# EasyEDA schematic ESP32_MASTER_SLAVE.json

## Sheets
1 ESP32_Master_Slave
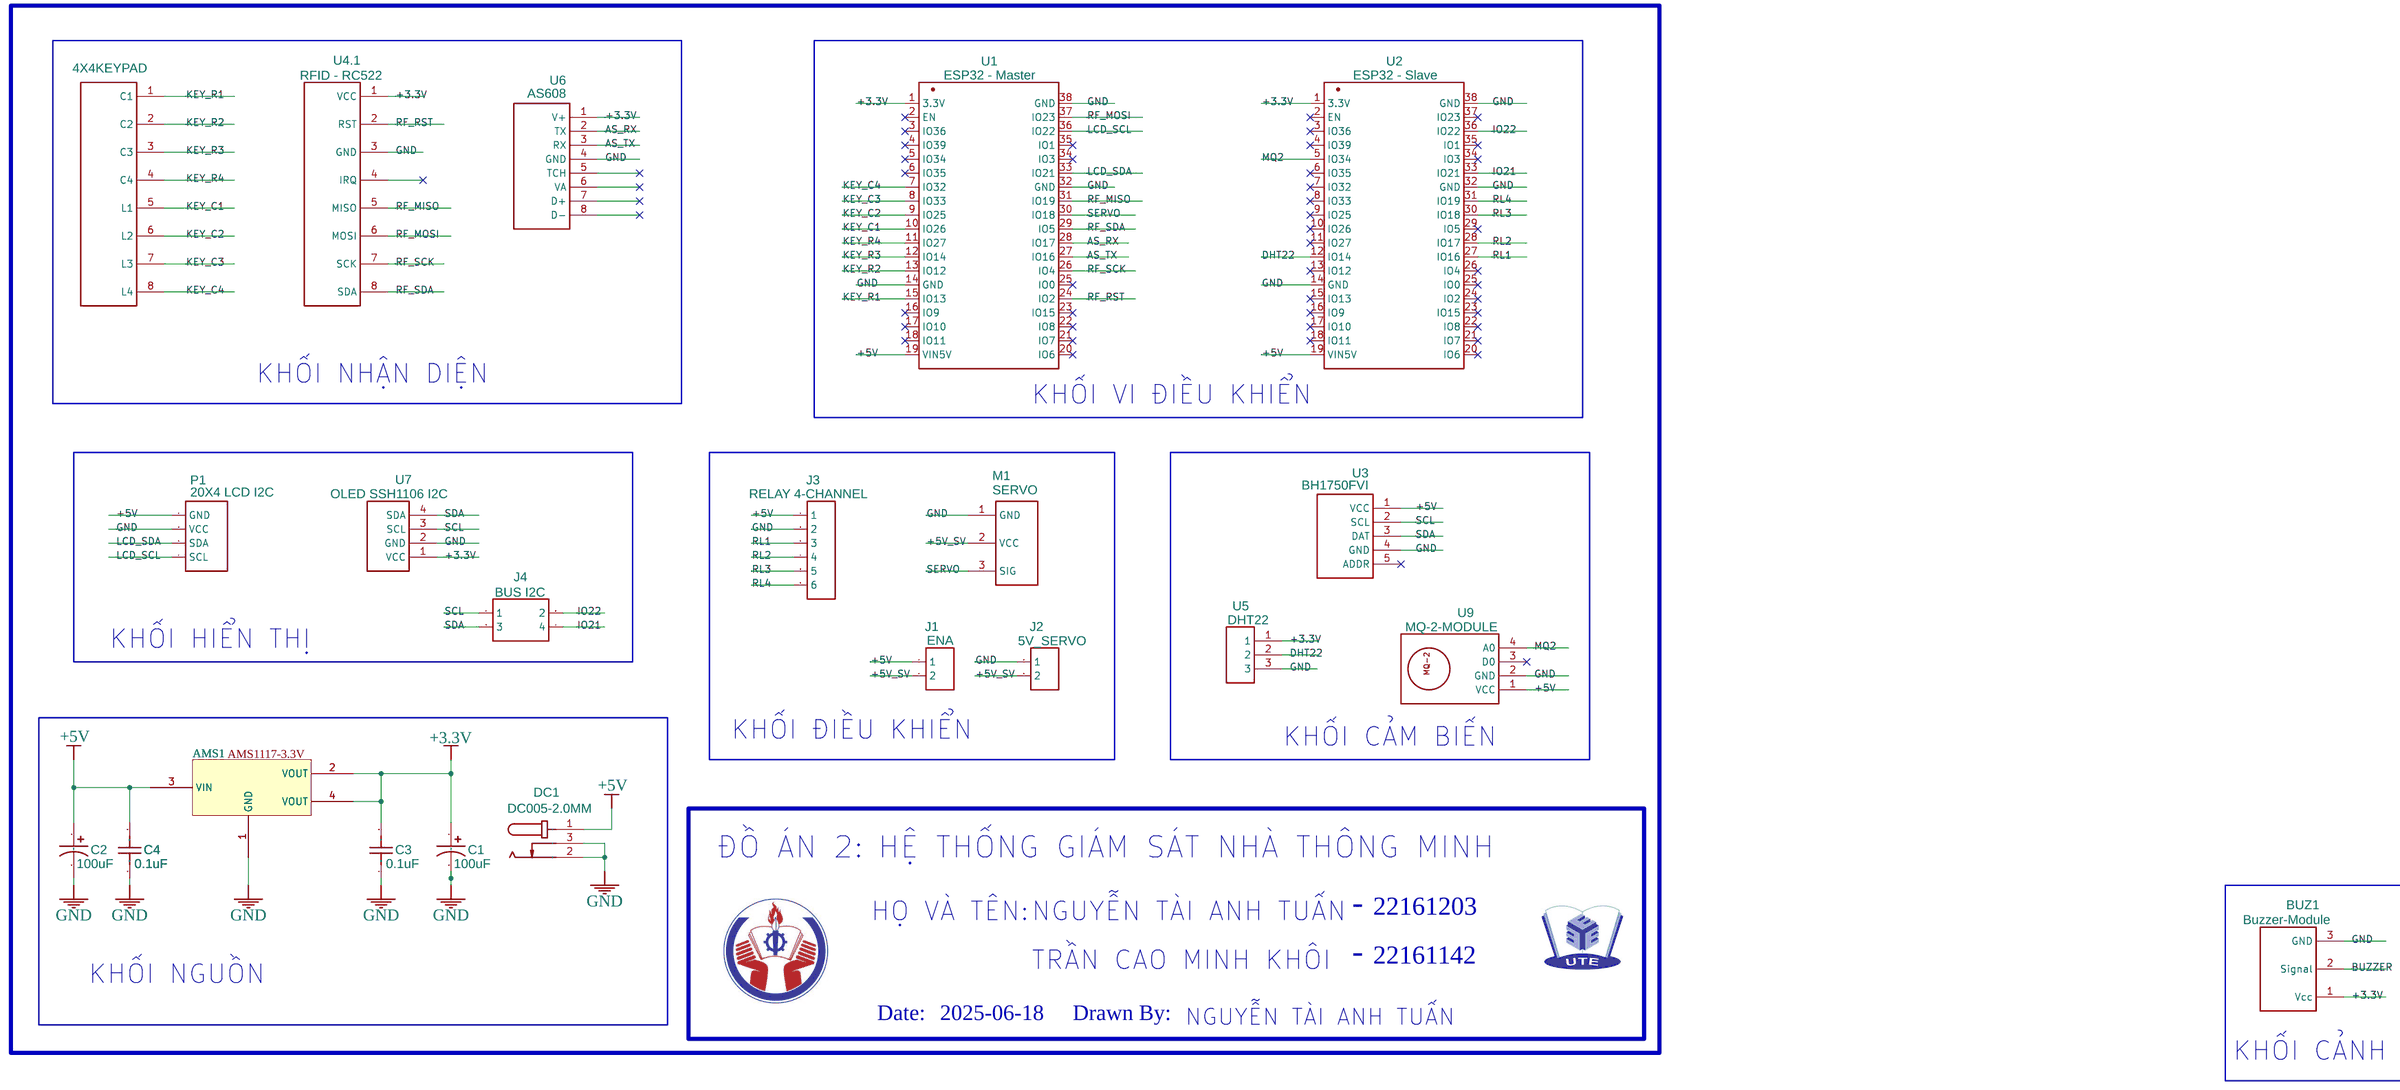
[diagram p0: ESP32_Master_Slave]
2 SDNL
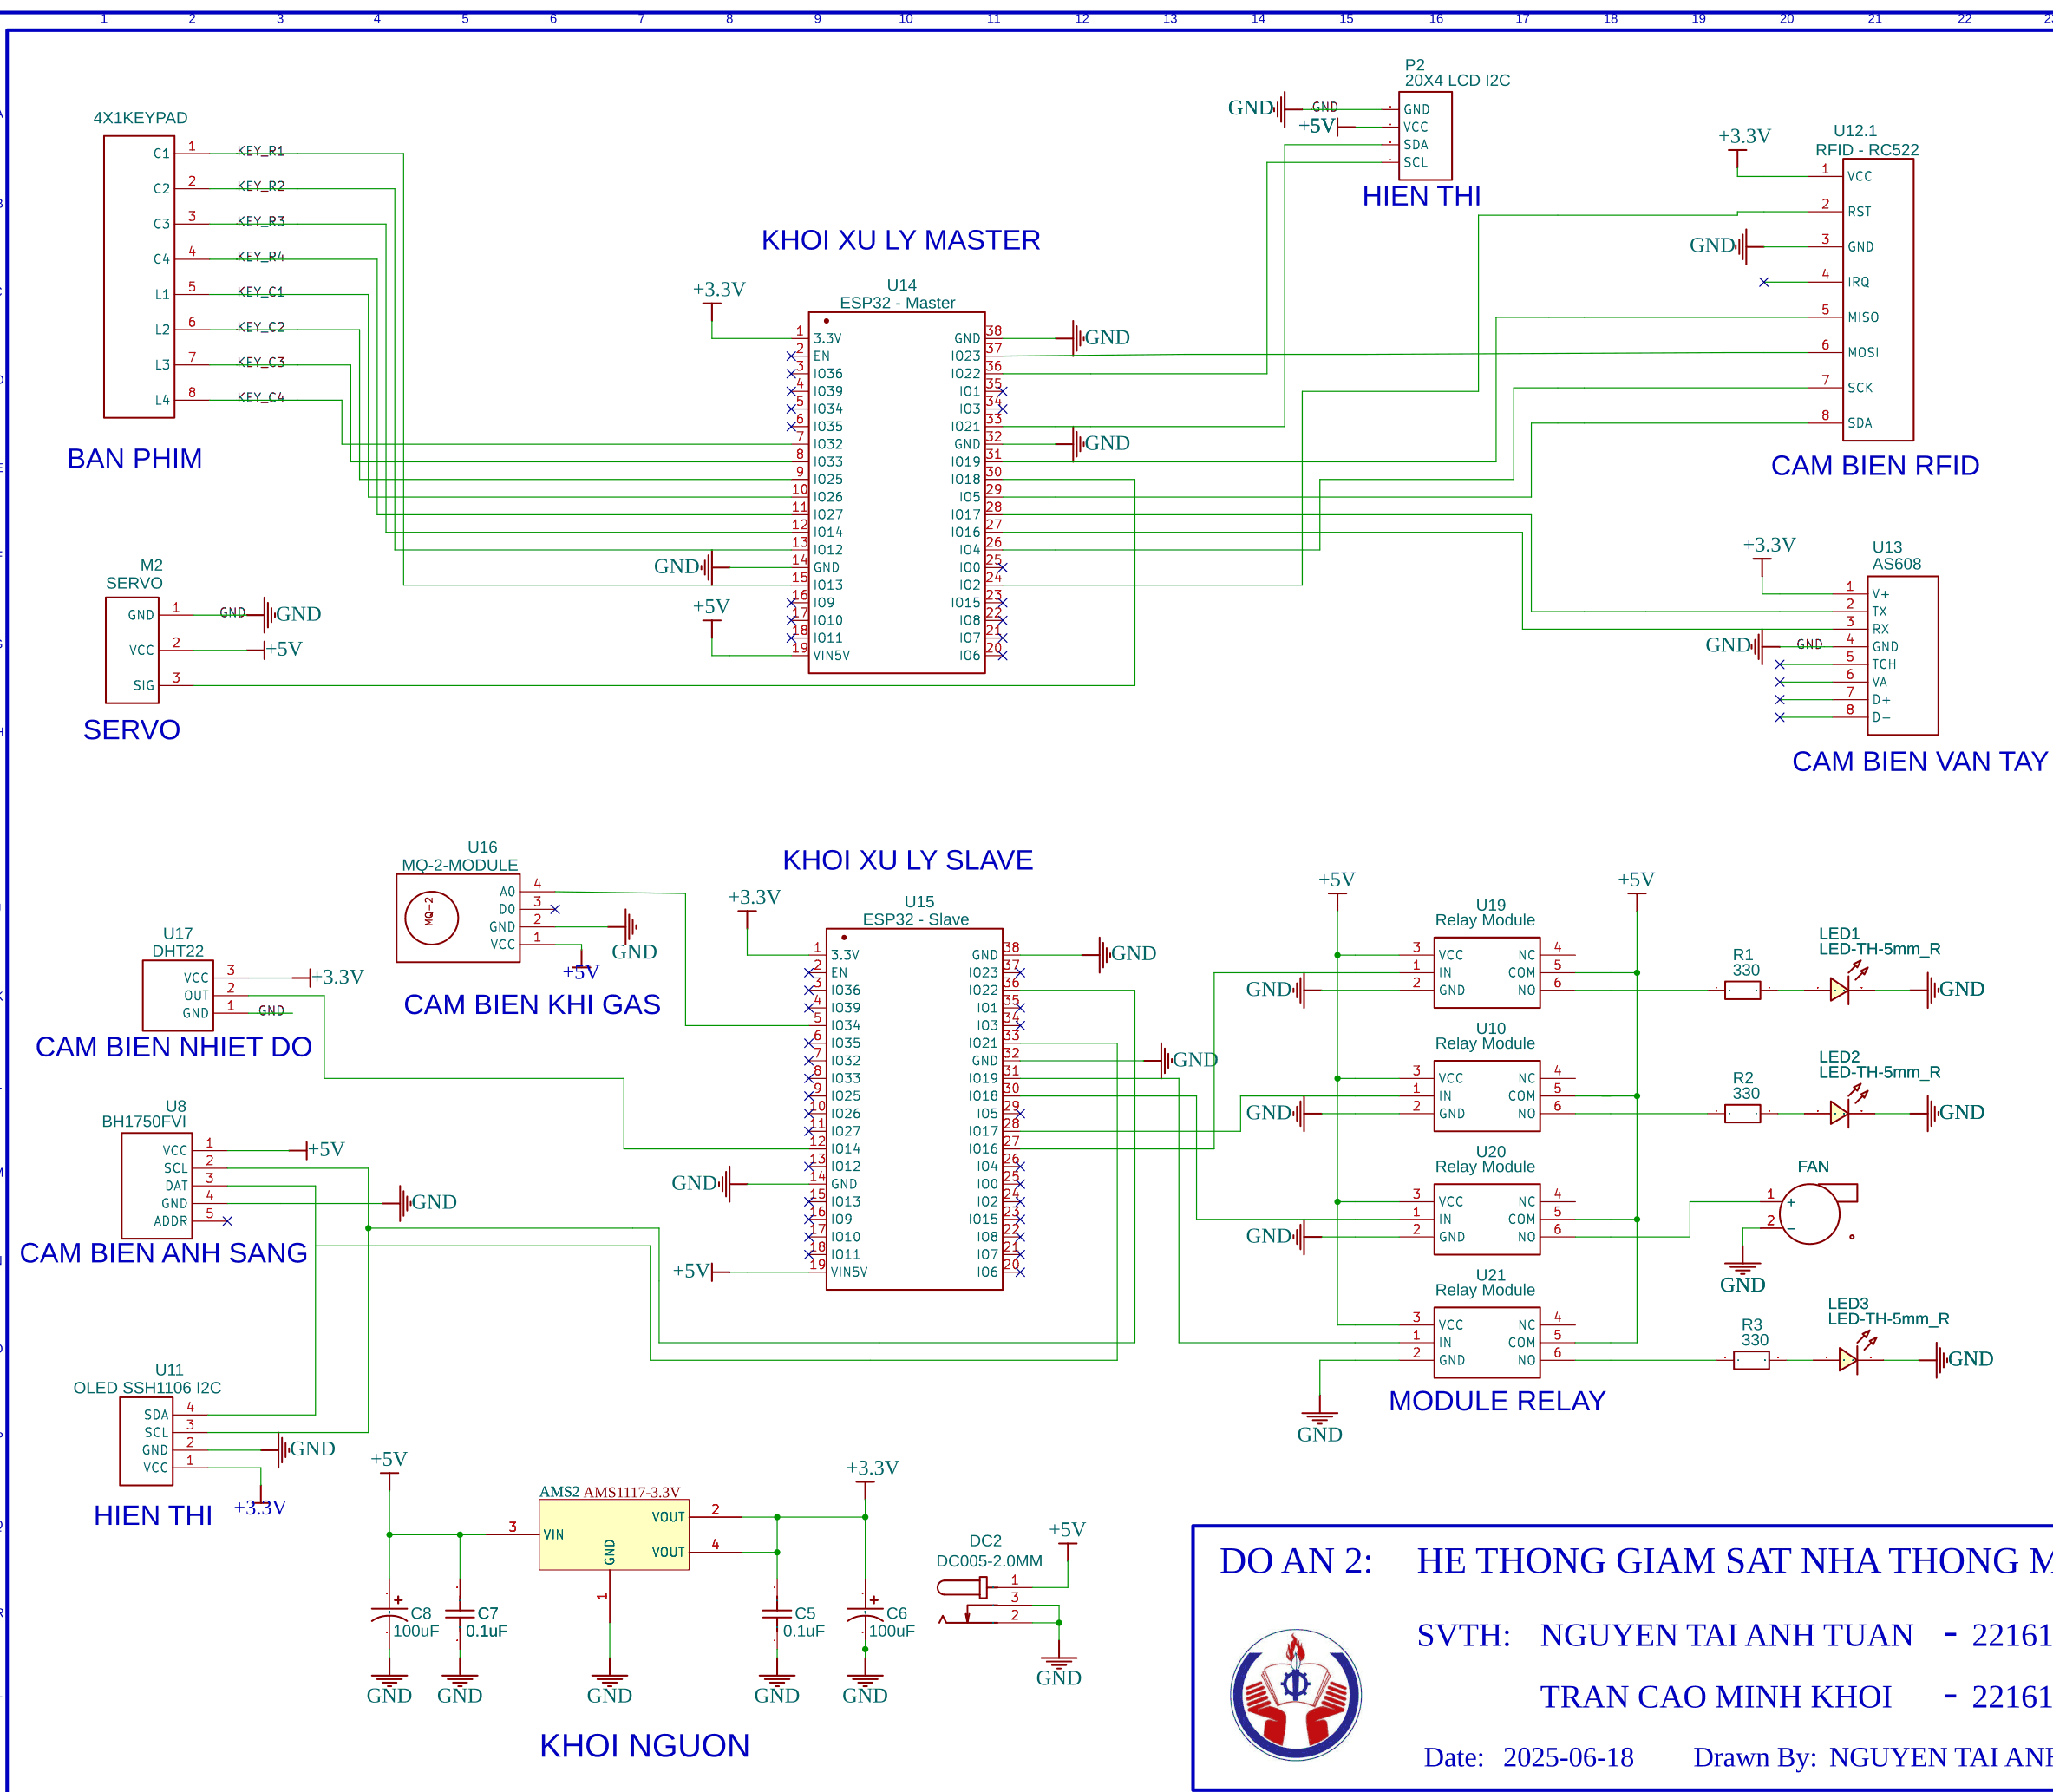
[diagram p1: SDNL]
3 Sheet_2
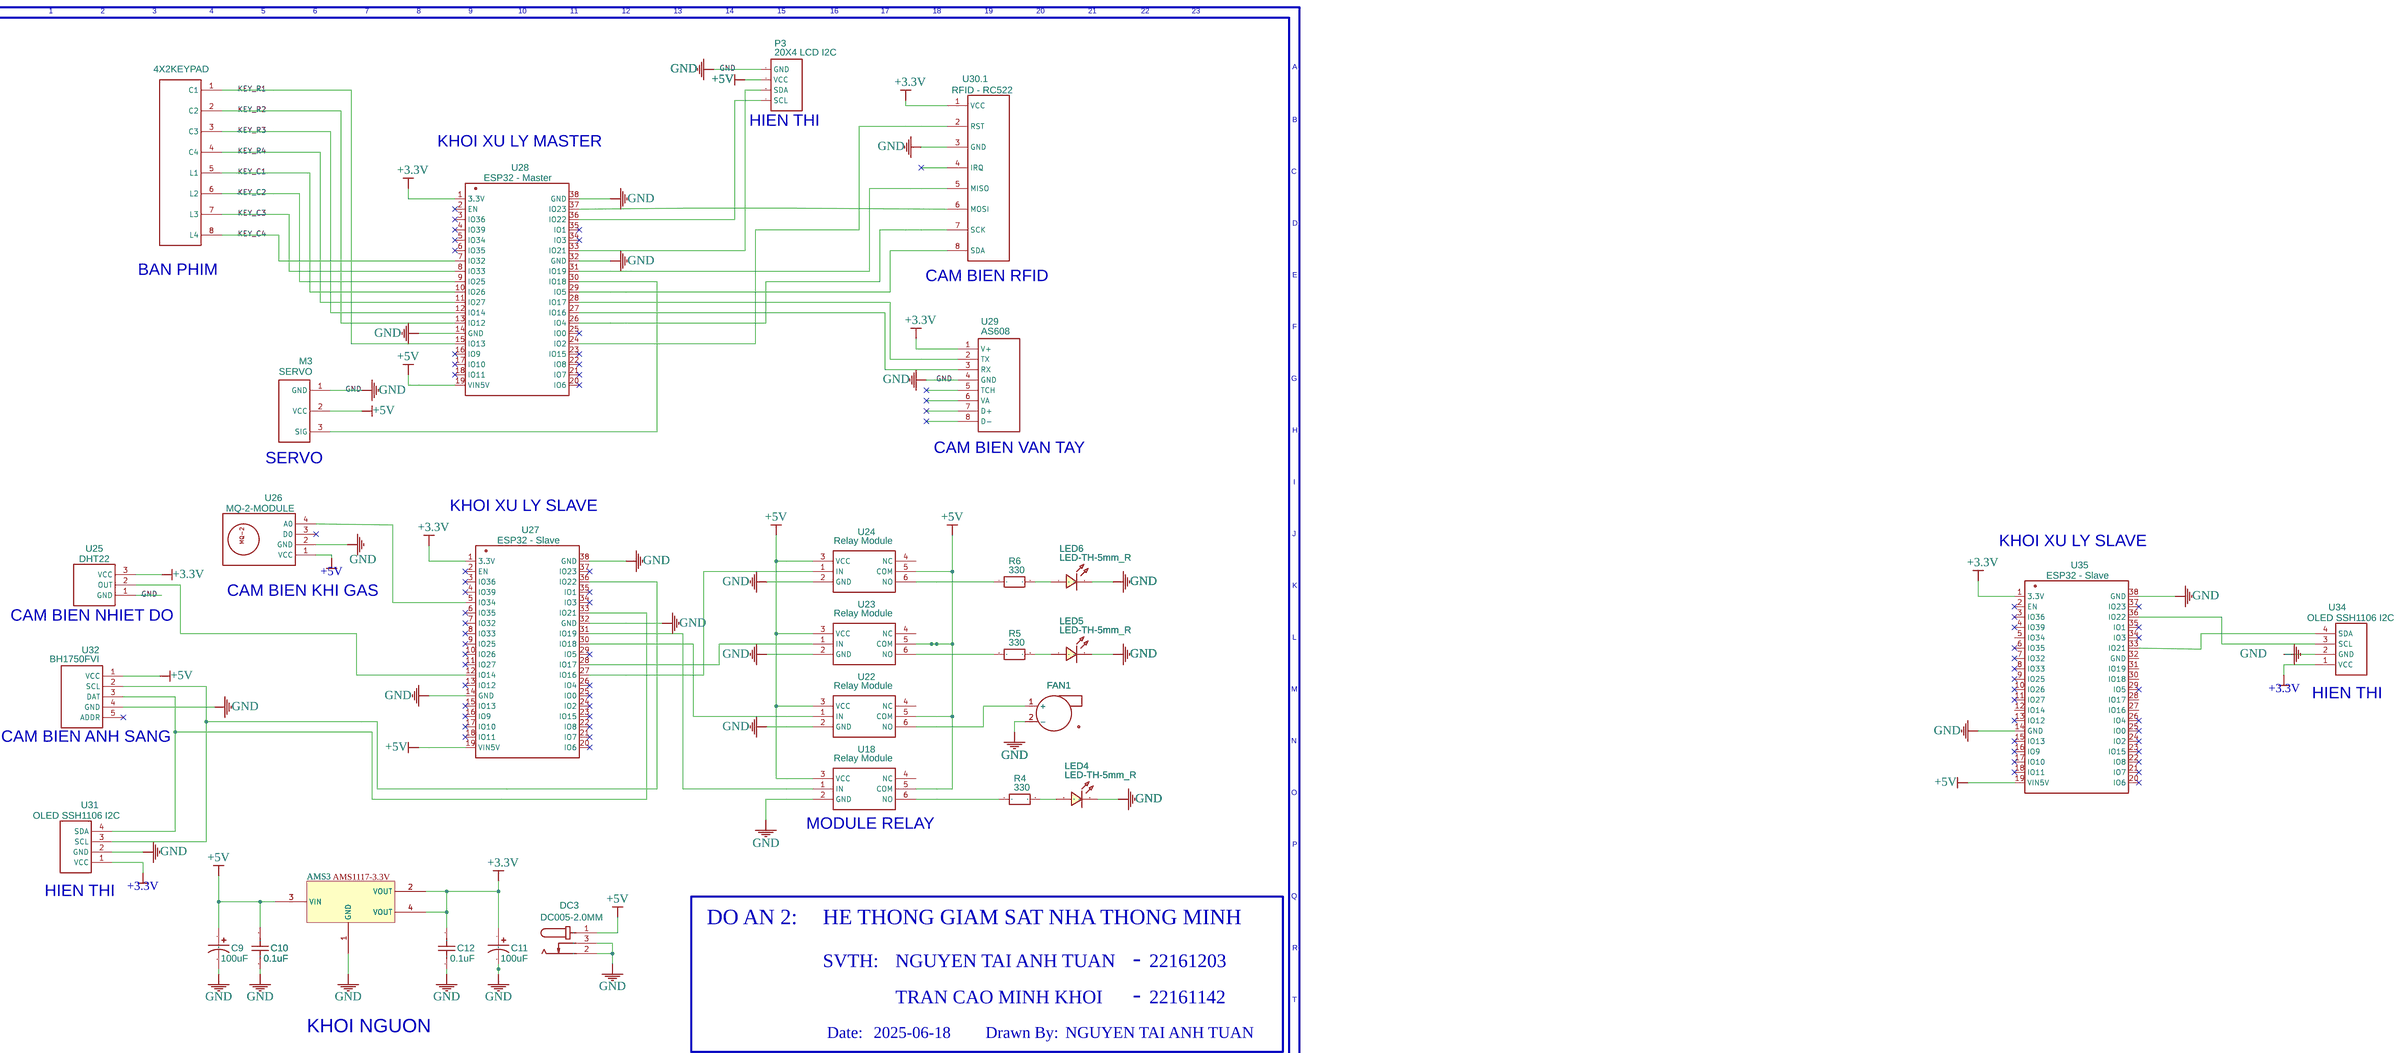
[diagram p2: Sheet_2]

## Parts
sheet ESP32_Master_Slave
4X4KEYPAD  4X4KEYPAD  [4X4KEYPAD]
AMS1  AMS1117-3.3V SOT223  [SOT223]
BUZ1  Buzzer-Module  [BUZZER-MODULE-EINAR]
C1  100uF  [CAP-D8.0×H10.5]
C2  100uF  [CAP-D8.0×H10.5]
C3  0.1uF  [C1206]
C4  0.1uF  [C1206]
DC1  DC005-2.0MM  [DC-IN-TH_DC005]
J1  ENA  [HDR-M-2.54_1X2]
J2  5V_SERVO  [HDR-M-2.54_1X2]
J3  RELAY 4-CHANNEL  [HDR-M-2.54_1X6]
J4  BUS I2C  [HDR-M-2.54_2X2]
M1  SERVO  [SERVO]
P1  20X4 LCD I2C  [20X4 LCD WITH I2C]
U1  ESP32 - Master  [ESP32-WROOM-32]
U2  ESP32 - Slave  [ESP32-WROOM-32]
U3  BH1750FVI  [BH1750FVI]
U4  RFID - RC522  [RFID-RC522]  (section 1)
U5  DHT22  [DHT22]
U6  AS608  [AS608]
U7  OLED SSH1106 I2C  [1.3_OLED_SSH1106_I2C_128X64_BOARD]
U9  MQ-2-MODULE  [SENSOR - MQ-2]
sheet SDNL
4X1KEYPAD  4X4KEYPAD  [4X4KEYPAD]
AMS2  AMS1117-3.3V SOT223  [SOT223]
C5  0.1uF  [C1206]
C6  100uF  [CAP-D8.0×H10.5]
C7  0.1uF  [C1206]
C8  100uF  [CAP-D8.0×H10.5]
DC2  DC005-2.0MM  [DC-IN-TH_DC005]
FAN  FAN  [FAN]
LED1  LED-TH-5mm_R  [LED-TH_BD5.0_RED]
LED2  LED-TH-5mm_R  [LED-TH_BD5.0_RED]
LED3  LED-TH-5mm_R  [LED-TH_BD5.0_RED]
M2  SERVO  [SERVO]
P2  20X4 LCD I2C  [20X4 LCD WITH I2C]
R1  330  [R0603]
R2  330  [R0603]
R3  330  [R0603]
U8  BH1750FVI  [BH1750FVI]
U10  Relay Module  [RELAY MODULE HW-279 2 RELAYS]
U11  OLED SSH1106 I2C  [1.3_OLED_SSH1106_I2C_128X64_BOARD]
U12  RFID - RC522  [RFID-RC522]  (section 1)
U13  AS608  [AS608]
U14  ESP32 - Master  [ESP32-WROOM-32]
U15  ESP32 - Slave  [ESP32-WROOM-32]
U16  MQ-2-MODULE  [SENSOR - MQ-2]
U17  DHT22  [DHT22]
U19  Relay Module  [RELAY MODULE HW-279 2 RELAYS]
U20  Relay Module  [RELAY MODULE HW-279 2 RELAYS]
U21  Relay Module  [RELAY MODULE HW-279 2 RELAYS]
sheet Sheet_2
4X2KEYPAD  4X4KEYPAD  [4X4KEYPAD]
AMS3  AMS1117-3.3V SOT223  [SOT223]
C9  100uF  [CAP-D8.0×H10.5]
C10  0.1uF  [C1206]
C11  100uF  [CAP-D8.0×H10.5]
C12  0.1uF  [C1206]
DC3  DC005-2.0MM  [DC-IN-TH_DC005]
FAN1  FAN  [FAN]
LED4  LED-TH-5mm_R  [LED-TH_BD5.0_RED]
LED5  LED-TH-5mm_R  [LED-TH_BD5.0_RED]
LED6  LED-TH-5mm_R  [LED-TH_BD5.0_RED]
M3  SERVO  [SERVO]
P3  20X4 LCD I2C  [20X4 LCD WITH I2C]
R4  330  [R0603]
R5  330  [R0603]
R6  330  [R0603]
U18  Relay Module  [RELAY MODULE HW-279 2 RELAYS]
U22  Relay Module  [RELAY MODULE HW-279 2 RELAYS]
U23  Relay Module  [RELAY MODULE HW-279 2 RELAYS]
U24  Relay Module  [RELAY MODULE HW-279 2 RELAYS]
U25  DHT22  [DHT22]
U26  MQ-2-MODULE  [SENSOR - MQ-2]
U27  ESP32 - Slave  [ESP32-WROOM-32]
U28  ESP32 - Master  [ESP32-WROOM-32]
U29  AS608  [AS608]
U30  RFID - RC522  [RFID-RC522]  (section 1)
U31  OLED SSH1106 I2C  [1.3_OLED_SSH1106_I2C_128X64_BOARD]
U32  BH1750FVI  [BH1750FVI]
U34  OLED SSH1106 I2C  [1.3_OLED_SSH1106_I2C_128X64_BOARD]
U35  ESP32 - Slave  [ESP32-WROOM-32]

## Library data of the parts
4X1KEYPAD 4X2KEYPAD 4X4KEYPAD = 4X4KEYPAD: Contributor: ilierazvan1497
AMS1-AMS3 = -: Don_Vi: Con; Ghi_Chu: *; Kieu_Chan: *; Ma_Hang: MH000596; Chung_Loai: Dán; Comment: AMS1117-3.3V
BUZ1 = Buzzer-Module-Einar: Contributor: einar2
C1 C2 C6 C8 C9 C11 = CE_SMD_D8.0×H10.5_US: Contributor: LCEDA_Lib
C3-C5 C7 C10 C12 = C_1206_US: Contributor: LCEDA_Lib
DC1-DC3 = DC005-2.0MM: Supplier: LCSC; Manufacturer: SOFNG; Supplier Part: C111567
J1 J2 = HDR-M-2.54_1x2: Supplier Part: C124375; Supplier: LCSC; Contributor: LCEDA_Lib
J3 = HDR-M-2.54_1x6: Supplier Part: C190819; Supplier: LCSC; Contributor: LCEDA_Lib
J4 = HDR-M-2.54_2x2: Supplier Part: C66690; Supplier: LCSC; Contributor: LCEDA_Lib
M1-M3 = SERVO: Manufacturer Part: New SchematicLib; Contributor: 陳詩函
P1-P3 = 20X4 LCD I2C: Supplier: LCSC; Manufacturer: ReliaPro; Manufacturer Part: Header-Female-2.54_1x4; Supplier Part: C124413
U1 U2 U14 U15 U27 U28 U35 = ESP32-WROOM-32_KEEYEES: Contributor: zamhxk
U3 U8 U32 = BH1750FVI: Contributor: van.habl
U4 U12 U30 = RC522 COPY COPY: Contributor: Baptiste Campion; subpart_no: 2
U5 = DHT22: Contributor: dasarisundeep1993
U6 U13 U29 = AS608: Supplier: Ambox; Contributor: v.v.vyalov
U7 U11 U31 U34 = 1.3in OLED SSH1106 I2C 128x64: Supplier: LIB1HR; Contributor: hrodriguez22
U9 U16 U26 = MQ-9-MODULE: Contributor: boerescu_daniel
FAN FAN1 = TURBINE COPY: Supplier: MOXA; Contributor: Aaron Ayala
LED1-LED6 = LED-TH-5mm_R: Manufacturer: EVERLIGHT(台湾亿光); Manufacturer Part: 333-2SURD/S530-A3; Supplier Part: C87271; Supplier: LCSC; Contributor: LCEDA_Lib
R1-R6 = R_0603_EU: Contributor: LCEDA_Lib
U10 U18-U24 = Relay Module 1 Channel: Contributor: abejero315
U17 U25 = DHT22: Supplier Part: C137589; Supplier: LCSC; Contributor: angelpool99

## Nets
+3.3V: AMS1.2(VOUT) AMS1.4(VOUT) AMS2.2(VOUT) AMS2.4(VOUT) AMS3.2(VOUT) AMS3.4(VOUT) BUZ1.1(Vcc) C1.1 C3.2 C5.2 C6.1 C11.1 C12.2 U1.1(3.3V) U2.1(3.3V) U4.1(VCC) U5.1 U6.1(V+) U7.1(VCC) U11.1(VCC) U12.1(VCC) U13.1(V+) U14.1(3.3V) U15.1(3.3V) U17.3(VCC) U25.3(VCC) U27.1(3.3V) U28.1(3.3V) U29.1(V+) U30.1(VCC) U31.1(VCC) U34.1(VCC) U35.1(3.3V)
+5V: AMS1.3(VIN) AMS2.3(VIN) AMS3.3(VIN) C2.1 C4.2 C7.2 C8.1 C9.1 C10.2 DC1.1 DC2.1 DC3.1 J1.1 J3.1 M2.2(VCC) M3.2(VCC) P1.1(GND) P2.2(VCC) P3.2(VCC) U1.19(VIN5V) U2.19(VIN5V) U3.1(VCC) U8.1(VCC) U9.1(VCC) U10.3(VCC) U14.19(VIN5V) U15.19(VIN5V) U16.1(VCC) U18.3(VCC) U18.5(COM) U19.3(VCC) U19.5(COM) U20.3(VCC) U20.5(COM) U21.3(VCC) U21.5(COM) U22.3(VCC) U22.5(COM) U23.3(VCC) U23.5(COM) U24.3(VCC) U24.5(COM) U26.1(VCC) U27.19(VIN5V) U28.19(VIN5V) U32.1(VCC) U35.19(VIN5V)
+5V_SV: J1.2 J2.2 M1.2(VCC)
GND: AMS1.1(GND) AMS2.1(GND) AMS3.1(GND) BUZ1.3(GND) C1.2 C2.2 C3.1 C4.1 C5.1 C6.2 C7.1 C8.2 C9.2 C10.1 C11.2 C12.1 DC1.2 DC1.3 DC2.2 DC2.3 DC3.2 DC3.3 FAN.2(-) FAN1.2(-) J2.1 J3.2 LED1.2 LED2.2 LED3.2 LED4.2 LED5.2 LED6.2 M1.1(GND) M2.1(GND) M3.1(GND) P1.2(VCC) P2.1(GND) P3.1(GND) U1.14(GND) U1.32(GND) U1.38(GND) U2.14(GND) U2.32(GND) U2.38(GND) U3.4(GND) U4.3(GND) U5.3 U6.4(GND) U7.2(GND) U8.4(GND) U9.2(GND) U10.2(GND) U11.2(GND) U12.3(GND) U13.4(GND) U14.14(GND) U14.32(GND) U14.38(GND) U15.14(GND) U15.32(GND) U15.38(GND) U16.2(GND) U17.1(GND) U18.2(GND) U19.2(GND) U20.2(GND) U21.2(GND) U22.2(GND) U23.2(GND) U24.2(GND) U25.1(GND) U26.2(GND) U27.14(GND) U27.32(GND) U27.38(GND) U28.14(GND) U28.32(GND) U28.38(GND) U29.4(GND) U30.3(GND) U31.2(GND) U32.4(GND) U34.2(GND) U35.14(GND) U35.38(GND)
AS_RX: U1.28(IO17) U6.2(TX)
AS_TX: U1.27(IO16) U6.3(RX)
BUZZER: BUZ1.2(Signal)
DHT22: U2.12(IO14) U5.2
IO21: J4.4 U2.33(IO21)
IO22: J4.2 U2.36(IO22)
KEY_C1: 4X1KEYPAD.5(L1) 4X2KEYPAD.5(L1) 4X4KEYPAD.5(L1) U1.10(IO26) U14.10(IO26) U28.10(IO26)
KEY_C2: 4X1KEYPAD.6(L2) 4X2KEYPAD.6(L2) 4X4KEYPAD.6(L2) U1.9(IO25) U14.9(IO25) U28.9(IO25)
KEY_C3: 4X1KEYPAD.7(L3) 4X2KEYPAD.7(L3) 4X4KEYPAD.7(L3) U1.8(IO33) U14.8(IO33) U28.8(IO33)
KEY_C4: 4X1KEYPAD.8(L4) 4X2KEYPAD.8(L4) 4X4KEYPAD.8(L4) U1.7(IO32) U14.7(IO32) U28.7(IO32)
KEY_R1: 4X1KEYPAD.1(C1) 4X2KEYPAD.1(C1) 4X4KEYPAD.1(C1) U1.15(IO13) U14.15(IO13) U28.15(IO13)
KEY_R2: 4X1KEYPAD.2(C2) 4X2KEYPAD.2(C2) 4X4KEYPAD.2(C2) U1.13(IO12) U14.13(IO12) U28.13(IO12)
KEY_R3: 4X1KEYPAD.3(C3) 4X2KEYPAD.3(C3) 4X4KEYPAD.3(C3) U1.12(IO14) U14.12(IO14) U28.12(IO14)
KEY_R4: 4X1KEYPAD.4(C4) 4X2KEYPAD.4(C4) 4X4KEYPAD.4(C4) U1.11(IO27) U14.11(IO27) U28.11(IO27)
LCD_SCL: P1.4(SCL) U1.36(IO22)
LCD_SDA: P1.3(SDA) U1.33(IO21)
MQ2: U2.5(IO34) U9.4(A0)
RF_MISO: U1.31(IO19) U4.5(MISO)
RF_MOSI: U1.37(IO23) U4.6(MOSI)
RF_RST: U1.24(IO2) U4.2(RST)
RF_SCK: U1.26(IO4) U4.7(SCK)
RF_SDA: U1.29(IO5) U4.8(SDA)
RL1: J3.3 U2.27(IO16)
RL2: J3.4 U2.28(IO17)
RL3: J3.5 U2.30(IO18)
RL4: J3.6 U2.31(IO19)
SCL: J4.1 U3.2(SCL) U7.3(SCL)
SDA: J4.3 U3.3(DAT) U7.4(SDA)
SERVO: M1.3(SIG) U1.30(IO18)
Net-(FAN1-1): FAN1.1(+) U22.6(NO)
Net-(FAN-1): FAN.1(+) U20.6(NO)
Net-(LED1-1): LED1.1 R1.2
Net-(LED2-1): LED2.1 R2.2
Net-(LED3-1): LED3.1 R3.2
Net-(LED4-1): LED4.1 R4.2
Net-(LED5-1): LED5.1 R5.2
Net-(LED6-1): LED6.1 R6.2
Net-(M2-3): M2.3(SIG) U14.30(IO18)
Net-(M3-3): M3.3(SIG) U28.30(IO18)
Net-(P2-3): P2.3(SDA) U14.33(IO21)
Net-(P2-4): P2.4(SCL) U14.36(IO22)
Net-(P3-3): P3.3(SDA) U28.33(IO21)
Net-(P3-4): P3.4(SCL) U28.36(IO22)
Net-(R1-1): R1.1 U19.6(NO)
Net-(R2-1): R2.1 U10.6(NO)
Net-(R3-1): R3.1 U21.6(NO)
Net-(R4-1): R4.1 U18.6(NO)
Net-(R5-1): R5.1 U23.6(NO)
Net-(R6-1): R6.1 U24.6(NO)
Net-(U8-2): U8.2(SCL) U11.3(SCL) U15.36(IO22)
Net-(U8-3): U8.3(DAT) U11.4(SDA)
Net-(U10-1): U10.1(IN) U15.28(IO17)
Net-(U12.1-2): U12.2(RST) U14.24(IO2)
Net-(U12.1-5): U12.5(MISO) U14.31(IO19)
Net-(U12.1-6): U12.6(MOSI) U14.37(IO23)
Net-(U12.1-7): U12.7(SCK) U14.26(IO4)
Net-(U12.1-8): U12.8(SDA) U14.29(IO5)
Net-(U13-2): U13.2(TX) U14.28(IO17)
Net-(U13-3): U13.3(RX) U14.27(IO16)
Net-(U15-5): U15.5(IO34) U16.4(A0)
Net-(U15-12): U15.12(IO14) U17.2(OUT)
Net-(U15-27): U15.27(IO16) U19.1(IN)
Net-(U15-30): U15.30(IO18) U20.1(IN)
Net-(U15-31): U15.31(IO19) U21.1(IN)
Net-(U18-1): U18.1(IN) U27.31(IO19)
Net-(U22-1): U22.1(IN) U27.30(IO18)
Net-(U23-1): U23.1(IN) U27.28(IO17)
Net-(U24-1): U24.1(IN) U27.27(IO16)
Net-(U25-2): U25.2(OUT) U27.12(IO14)
Net-(U26-4): U26.4(A0) U27.5(IO34)
Net-(U27-33): U27.33(IO21) U31.4(SDA) U32.3(DAT)
Net-(U27-36): U27.36(IO22) U31.3(SCL) U32.2(SCL)
Net-(U28-24): U28.24(IO2) U30.2(RST)
Net-(U28-26): U28.26(IO4) U30.7(SCK)
Net-(U28-27): U28.27(IO16) U29.3(RX)
Net-(U28-28): U28.28(IO17) U29.2(TX)
Net-(U28-29): U28.29(IO5) U30.8(SDA)
Net-(U28-31): U28.31(IO19) U30.5(MISO)
Net-(U28-37): U28.37(IO23) U30.6(MOSI)
Net-(U34-3): U34.3(SCL) U35.36(IO22)
Net-(U34-4): U34.4(SDA) U35.33(IO21)

Not connected (* = marked no-connect by the designer): U1 2(EN)* 3(IO36)* 4(IO39)* 5(IO34)* 6(IO35)* 16(IO9)* 17(IO10)* 18(IO11)* 20(IO6)* 21(IO7)* 22(IO8)* 23(IO15)* 25(IO0)* 34(IO3)* 35(IO1)*; U2 2(EN)* 3(IO36)* 4(IO39)* 6(IO35)* 7(IO32)* 8(IO33)* 9(IO25)* 10(IO26)* 11(IO27)* 13(IO12)* 15(IO13)* 16(IO9)* 17(IO10)* 18(IO11)* 20(IO6)* 21(IO7)* 22(IO8)* 23(IO15)* 24(IO2)* 25(IO0)* 26(IO4)* 29(IO5)* 34(IO3)* 35(IO1)* 37(IO23)*; U3 5(ADDR)*; U4 4(IRQ); U6 5(TCH) 6(VA) 7(D+) 8(D-); U8 5(ADDR)*; U9 3(D0)*; U10 4(NC) 5(COM); U12 4(IRQ); U13 5(TCH) 6(VA) 7(D+) 8(D-); U14 2(EN)* 3(IO36)* 4(IO39)* 5(IO34)* 6(IO35)* 16(IO9)* 17(IO10)* 18(IO11)* 20(IO6)* 21(IO7)* 22(IO8)* 23(IO15)* 25(IO0)* 34(IO3)* 35(IO1)*; U15 2(EN)* 3(IO36)* 4(IO39)* 6(IO35)* 7(IO32)* 8(IO33)* 9(IO25)* 10(IO26)* 11(IO27)* 13(IO12)* 15(IO13)* 16(IO9)* 17(IO10)* 18(IO11)* 20(IO6)* 21(IO7)* 22(IO8)* 23(IO15)* 24(IO2)* 25(IO0)* 26(IO4)* 29(IO5)* 33(IO21) 34(IO3)* 35(IO1)* 37(IO23)*; U16 3(D0)*; U18 4(NC); U19 4(NC); U20 4(NC); U21 4(NC); U22 4(NC); U23 4(NC); U24 4(NC); U26 3(D0)*; U27 2(EN)* 3(IO36)* 4(IO39)* 6(IO35)* 7(IO32)* 8(IO33)* 9(IO25)* 10(IO26)* 11(IO27)* 13(IO12)* 15(IO13)* 16(IO9)* 17(IO10)* 18(IO11)* 20(IO6)* 21(IO7)* 22(IO8)* 23(IO15)* 24(IO2)* 25(IO0)* 26(IO4)* 29(IO5)* 34(IO3)* 35(IO1)* 37(IO23)*; U28 2(EN)* 3(IO36)* 4(IO39)* 5(IO34)* 6(IO35)* 16(IO9)* 17(IO10)* 18(IO11)* 20(IO6)* 21(IO7)* 22(IO8)* 23(IO15)* 25(IO0)* 34(IO3)* 35(IO1)*; U29 5(TCH) 6(VA) 7(D+) 8(D-); U30 4(IRQ); U32 5(ADDR)*; U35 2(EN)* 3(IO36)* 4(IO39)* 5(IO34) 6(IO35)* 7(IO32)* 8(IO33)* 9(IO25)* 10(IO26)* 11(IO27)* 12(IO14) 13(IO12)* 15(IO13)* 16(IO9)* 17(IO10)* 18(IO11)* 20(IO6)* 21(IO7)* 22(IO8)* 23(IO15)* 24(IO2)* 25(IO0)* 26(IO4)* 27(IO16) 28(IO17) 29(IO5)* 30(IO18) 31(IO19) 32(GND) 34(IO3)* 35(IO1)* 37(IO23)*

## Notes on the sheets
sheet 1
- KHỐI NHẬN DIỆN
- KHỐI VI ĐIỀU KHIỂN
- KHỐI HIỂN THỊ
- KHỐI ĐIỀU KHIỂN
- KHỐI CẢM BIẾN
- ĐỒ ÁN 2:
- HỆ THỐNG GIÁM SÁT NHÀ THÔNG MINH
- -
- HỌ VÀ TÊN:
- NGUYỄN TÀI ANH TUẤN
- 22161203
- -
- KHỐI NGUỒN
- TRẦN CAO MINH KHÔI
- 22161142
- Date:
- 2025-06-18
- Drawn By:
- NGUYỄN TÀI ANH TUẤN
- KHỐI CẢNH BÁO
sheet 2
- 1
- 2
- 3
- 4
- 5
- 6
- 7
- 8
- 9
- 10
- 11
- 12
- 13
- 14
- 15
- 16
- 17
- 18
- 19
- 20
- 21
- 22
- 23
- A
- A
- B
- HIEN THI
- B
- KHOI XU LY MASTER
- C
- C
- D
- D
- BAN PHIM
- E
- CAM BIEN RFID
- E
- F
- F
- G
- G
- SERVO
- H
- H
- CAM BIEN VAN TAY
- I
- I
- KHOI XU LY SLAVE
- J
- J
- K
- K
- CAM BIEN KHI GAS
- CAM BIEN NHIET DO
- L
- L
- M
- M
- N
- CAM BIEN ANH SANG
- N
- O
- O
- MODULE RELAY
- P
- P
- HIEN THI
- Q
- Q
- DO AN 2:
- HE THONG GIAM SAT NHA THONG MINH
- R
- R
- SVTH:
- NGUYEN TAI ANH TUAN
- -
- 22161203
- T
- TRAN CAO MINH KHOI
- -
- 22161142
- T
- KHOI NGUON
- Date:
- 2025-06-18
- Drawn By:
- NGUYEN TAI ANH TUAN
- 1
- 2
- 3
- 4
- 5
- 6
- 7
- 8
- 9
- 10
- 11
- 12
- 13
- 14
- 15
- 16
- 17
- 18
- 19
- 20
- 21
- 22
- 23
sheet 3
- 1
- 2
- 3
- 4
- 5
- 6
- 7
- 8
- 9
- 10
- 11
- 12
- 13
- 14
- 15
- 16
- 17
- 18
- 19
- 20
- 21
- 22
- 23
- A
- A
- B
- HIEN THI
- B
- KHOI XU LY MASTER
- C
- C
- D
- D
- BAN PHIM
- CAM BIEN RFID
- E
- E
- F
- F
- G
- G
- H
- H
- SERVO
- CAM BIEN VAN TAY
- I
- I
- KHOI XU LY SLAVE
- J
- J
- KHOI XU LY SLAVE
- K
- CAM BIEN KHI GAS
- K
- CAM BIEN NHIET DO
- L
- L
- M
- M
- HIEN THI
- CAM BIEN ANH SANG
- N
- N
- O
- O
- MODULE RELAY
- P
- P
- Q
- HIEN THI
- Q
- DO AN 2:
- HE THONG GIAM SAT NHA THONG MINH
- R
- SVTH:
- NGUYEN TAI ANH TUAN
- -
- 22161203
- R
- TRAN CAO MINH KHOI
- -
- 22161142
- T
- T
- KHOI NGUON
- Date:
- 2025-06-18
- Drawn By:
- NGUYEN TAI ANH TUAN
- 1
- 2
- 3
- 4
- 5
- 6
- 7
- 8
- 9
- 10
- 11
- 12
- 13
- 14
- 15
- 16
- 17
- 18
- 19
- 20
- 21
- 22
- 23
